# Altium schematic sheet PCI short card universal - 32 BIT-2.schdoc
size A3
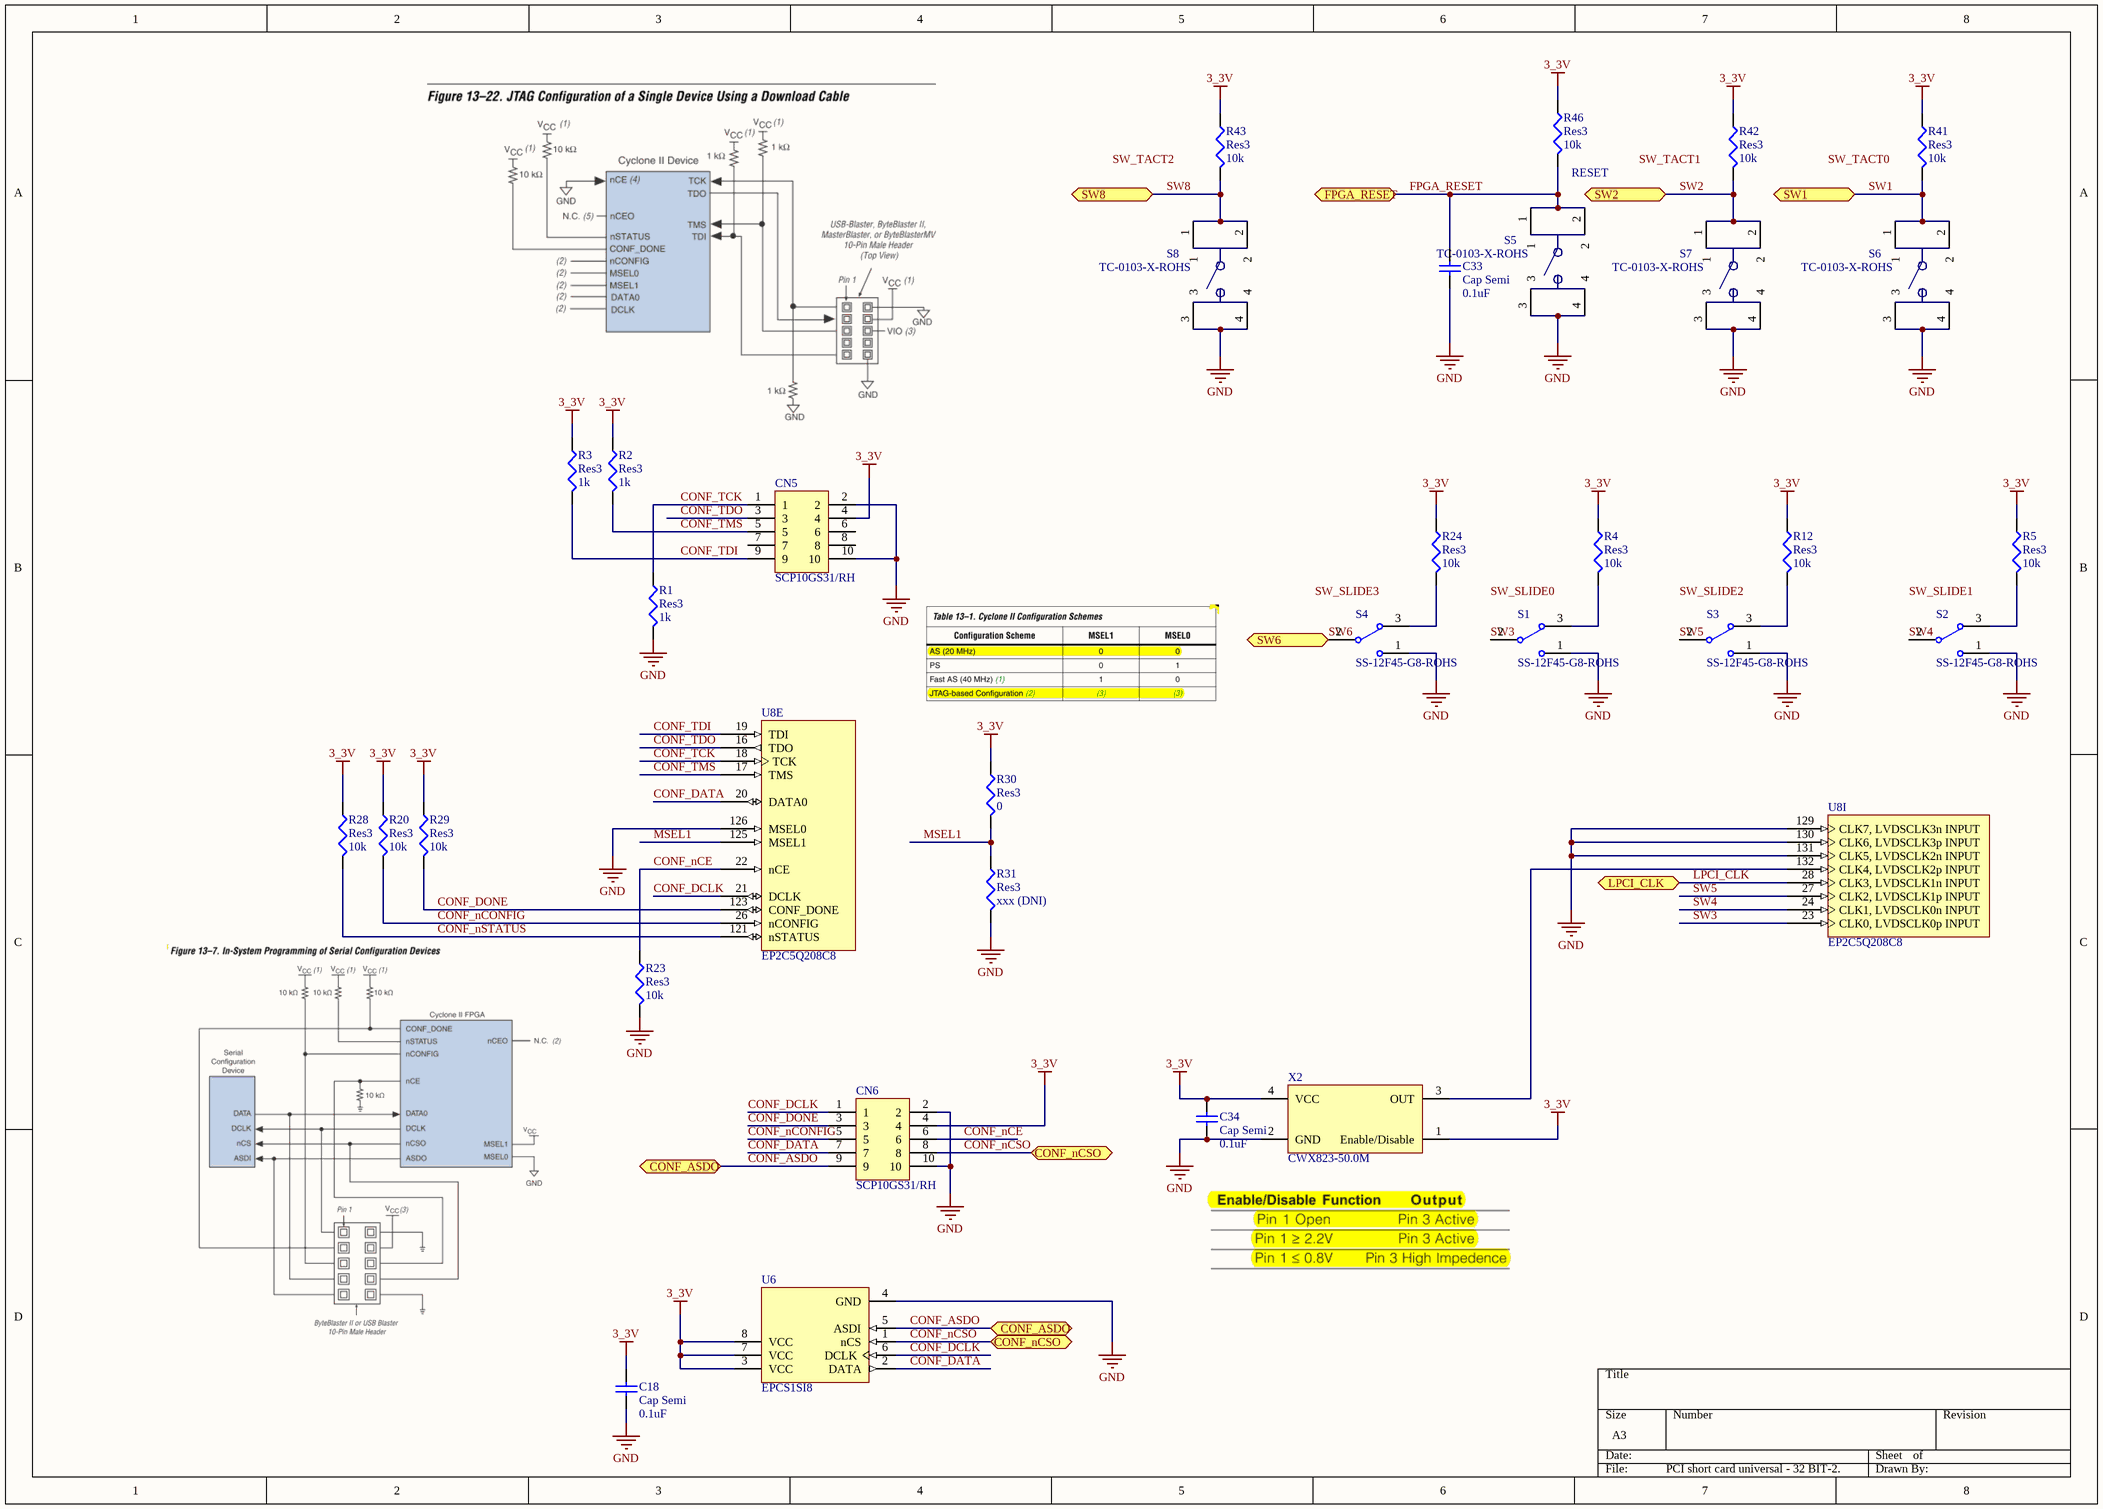
[diagram p0: PCI short card universal - 32 BIT-2.schdoc]

## Parts
C18  Cap Semi  value 0.1uF  [RESC1608N]
C33  Cap Semi  value 0.1uF  [RESC1608N]
C34  Cap Semi  value 0.1uF  [RESC1608N]
CN5  SCP10GS31/RH  [SCP10GS31/RH]
CN6  SCP10GS31/RH  [SCP10GS31/RH]
R1  Res3  value 1k  [RESC1608N]
R2  Res3  value 1k  [RESC1608N]
R3  Res3  value 1k  [RESC1608N]
R4  Res3  value 10k  [RESC1608N]
R5  Res3  value 10k  [RESC1608N]
R12  Res3  value 10k  [RESC1608N]
R20  Res3  value 10k  [RESC1608N]
R23  Res3  value 10k  [RESC1608N]
R24  Res3  value 10k  [RESC1608N]
R28  Res3  value 10k  [RESC1608N]
R29  Res3  value 10k  [RESC1608N]
R30  Res3  value 0  [RESC1608N]
R31  Res3  value xxx (DNI)  [RESC1608N]
R41  Res3  value 10k  [RESC1608N]
R42  Res3  value 10k  [RESC1608N]
R43  Res3  value 10k  [RESC1608N]
R46  Res3  value 10k  [RESC1608N]
S1  SS-12F45-G8-ROHS  [SLIDE_SW_2TYPE]
S2  SS-12F45-G8-ROHS  [SLIDE_SW_2TYPE]
S3  SS-12F45-G8-ROHS  [SLIDE_SW_2TYPE]
S4  SS-12F45-G8-ROHS  [SLIDE_SW_2TYPE]
S5  TC-0103-X-ROHS  [TACK_SW 6x6mm]
S6  TC-0103-X-ROHS  [TACK_SW 6x6mm]
S7  TC-0103-X-ROHS  [TACK_SW 6x6mm]
S8  TC-0103-X-ROHS  [TACK_SW 6x6mm]
U6  EPCS1SI8  [SOIC8_L]
U8  EP2C5Q208C8  [PQFP208_N]  (parts E,I of 9)
X2  CWX823-50.0M  [CWX823-50.0M]

## Ports
CONF_ASDO, CONF_nCSO, FPGA_RESET, LPCI_CLK, SW1, SW2, SW6, SW8

## Nets
3_3V: C18.2 C34.2 CN5.4 CN6.4 R2.1 R3.1 R4.1 R5.1 R12.1 R20.1 R24.1 R28.1 R29.1 R30.1 R41.1 R42.1 R43.1 R46.1 U6.3(VCC) U6.7(VCC) U6.8(VCC) X2.1(Enable/Disable) X2.4(VCC)
GND: C18.1 C33.1 C34.1 CN5.2 CN5.10 CN6.2 CN6.10 R1.2 R23.2 R31.2 S1.1 S2.1 S3.1 S4.1 S5.3 S5.4 S6.3 S6.4 S7.3 S7.4 S8.3 S8.4 U6.4(GND) U8.126(MSEL0) U8.129(CLK7,_LVDSCLK3n_INPUT) U8.130(CLK6,_LVDSCLK3p_INPUT) U8.131(CLK5,_LVDSCLK2n_INPUT) X2.2(GND)
CONF_ASDO: CN6.9 U6.5(ASDI) ; port CONF_ASDO
CONF_DATA: CN6.7 U6.2(DATA) U8.20(DATA0)
CONF_DCLK: CN6.1 U6.6(DCLK) U8.21(DCLK)
CONF_DONE: CN6.3 R29.2 U8.123(CONF_DONE)
CONF_nCE: CN6.6 R23.1 U8.22(nCE)
CONF_nCONFIG: CN6.5 R20.2 U8.26(nCONFIG)
CONF_nCSO: CN6.8 U6.1(nCS) ; port CONF_nCSO
CONF_nSTATUS: R28.2 U8.121(nSTATUS)
CONF_TCK: CN5.1 R1.1 U8.18(TCK)
CONF_TDI: CN5.9 R3.2 U8.19(TDI)
CONF_TDO: CN5.3 U8.16(TDO)
CONF_TMS: CN5.5 R2.2 U8.17(TMS)
FPGA_RESET: C33.2 R46.2 S5.1 S5.2 ; port FPGA_RESET
LPCI_CLK: U8.28(CLK3,_LVDSCLK1n_INPUT) ; port LPCI_CLK
MSEL1: R30.2 R31.1 U8.125(MSEL1)
SW1: R41.2 S6.1 S6.2 ; port SW1
SW2: R42.2 S7.1 S7.2 ; port SW2
SW3: S1.2 U8.23(CLK0,_LVDSCLK0p_INPUT)
SW4: S2.2 U8.24(CLK1,_LVDSCLK0n_INPUT)
SW5: S3.2 U8.27(CLK2,_LVDSCLK1p_INPUT)
SW6: S4.2 ; port SW6
SW8: R43.2 S8.1 S8.2 ; port SW8
NetR4_2: R4.2 S1.3
NetR5_2: R5.2 S2.3
NetR12_2: R12.2 S3.3
NetR24_2: R24.2 S4.3
NetU8_132: U8.132(CLK4,_LVDSCLK2p_INPUT) X2.3(OUT)

Not connected (* = marked no-connect by the designer): CN5 6 7 8

## Notes on the sheet
- (near R46) RESET
- Labels drawn without touching a wire or pin: SW_SLIDE0, SW_SLIDE1, SW_SLIDE2, SW_SLIDE3, SW_TACT0, SW_TACT1, SW_TACT2

## Library data of the parts
C18 C33 C34 = Cap Semi: Capacitor (Semiconductor SIM Model); Published: 8-Jun-2000; LatestRevisionDate: 17-Jul-2002; LatestRevisionNote: Re-released for DXP Platform.; PackageReference: C1206; Publisher: Altium Limited
CN5 = SCP10GS31/RH: GTK
R1-R5 R12 R20 R23 R24 R28-R31 R41-R43 R46 = Res3: Resistor; Published: 8-Jun-2000; LatestRevisionDate: 04-Mar-2005; LatestRevisionNote: PCB Footprint replaced.; PackageReference: J1-0603; Publisher: Altium Limited
S1-S4 = SW-SPDT: WEALTH METAL; Published: 24-Mar-1999; LatestRevisionDate: 17-Dec-2003; LatestRevisionNote: Schematic revised, PCB Footprint replaced.; DatasheetDocument: 05-Dec-2000; PackageReference: TL36WW15050; Publisher: Altium Limited; ComponentLink1Description: Manufacturer Link; ComponentLink1URL: http://www.apem.com
S5-S8 = TC-0103-X-ROHS: WEALTH METAL
U6 = EPCS1SI8: ALTERA EPCS1 Series, In-system programmable 3.3V serial configuration device, 8-Pin SOIC, 1-Megabit, Industrial Grade; Configures: Cyclone II, Stratix II, & Cyclone Devices; Published: 17-Sep-2003; LatestRevisionDate: 13-Apr-2006; LatestRevisionNote: IPC-7351 Footprint Added.; DatasheetVersion: ver2.0, Oct-2003; PackageVersion: ver13.0, May-2005; PackageReference: SOIC8; Publisher: Altium Limited; PackageDescription: 8-Pin Small Outline Integrated Circuit Package (SOIC8); Code_JEDEC: MS-012-AA; Code_IPC: SOIC127P600-8; ComponentLink1Description: Manufacturer Link; ComponentLink1URL: http://www.altera.com/products/devices/config/cfg-index.html; ComponentLink2Description: Configuration Handbook; ComponentLink2URL: http://www.altera.com/literature/hb/cfg/config_handbook.pdf; ComponentLink3Description: Pinout Specification; ComponentLink3URL: http://www.altera.com/literature/hb/cfg/cyc_c51014.pdf; ComponentLink4Description: Packaging Specification; ComponentLink4URL: http://www.altera.com/literature/ds/dspkg.pdf
U8 = EP2C5Q208C8: ALTERA Cyclone II Family, 1.2V FPGA, 142 I/O Pins, 2 PLLs, 208-Pin PQFP, Speed Grade 8, Commercial Grade; Note: DQS signal pins named according to DQ bus modes.  "/" separates each mode. ie. Modes x8/x9 / Modes x16/x18.; Published: 4-Mar-2005; LatestRevisionDate: 13-Apr-2006; LatestRevisionNote: IPC-7351 Footprint Added.; DatasheetVersion: ver2.3, Mar-2006; PackageVersion: ver14.2, Oct-2005; PackageReference: PQFP208; Publisher: Altium Limited; PackageDescription: 208-Pin Plastic Quad Flat Pack (PQFP208); Code_JEDEC: MS-029-FA-1; ComponentLink1Description: Manufacturer Link; ComponentLink1URL: http://www.altera.com/products/devices/cyclone2/cy2-index.jsp; ComponentLink2Description: Handbook; ComponentLink2URL: http://www.altera.com/literature/hb/cyc2/cyc2_cii5v1.pdf; ComponentLink3Description: Packaging Specification; ComponentLink3URL: http://www.altera.com/literature/ds/dspkg.pdf
X2 = CWX823-50.0M: CONNOR-WINFIELD